# EasyEDA Pro project 智能水杯垫.epro, schematic Schematic1
Create Date: 2024-09-26; Page Name: P1; Project Name: 智能水杯垫; Schematic Name: Schematic1; Update Date: 2024-10-15; Company: 嘉立创EDA; Page Size: A4; Version: V1.0
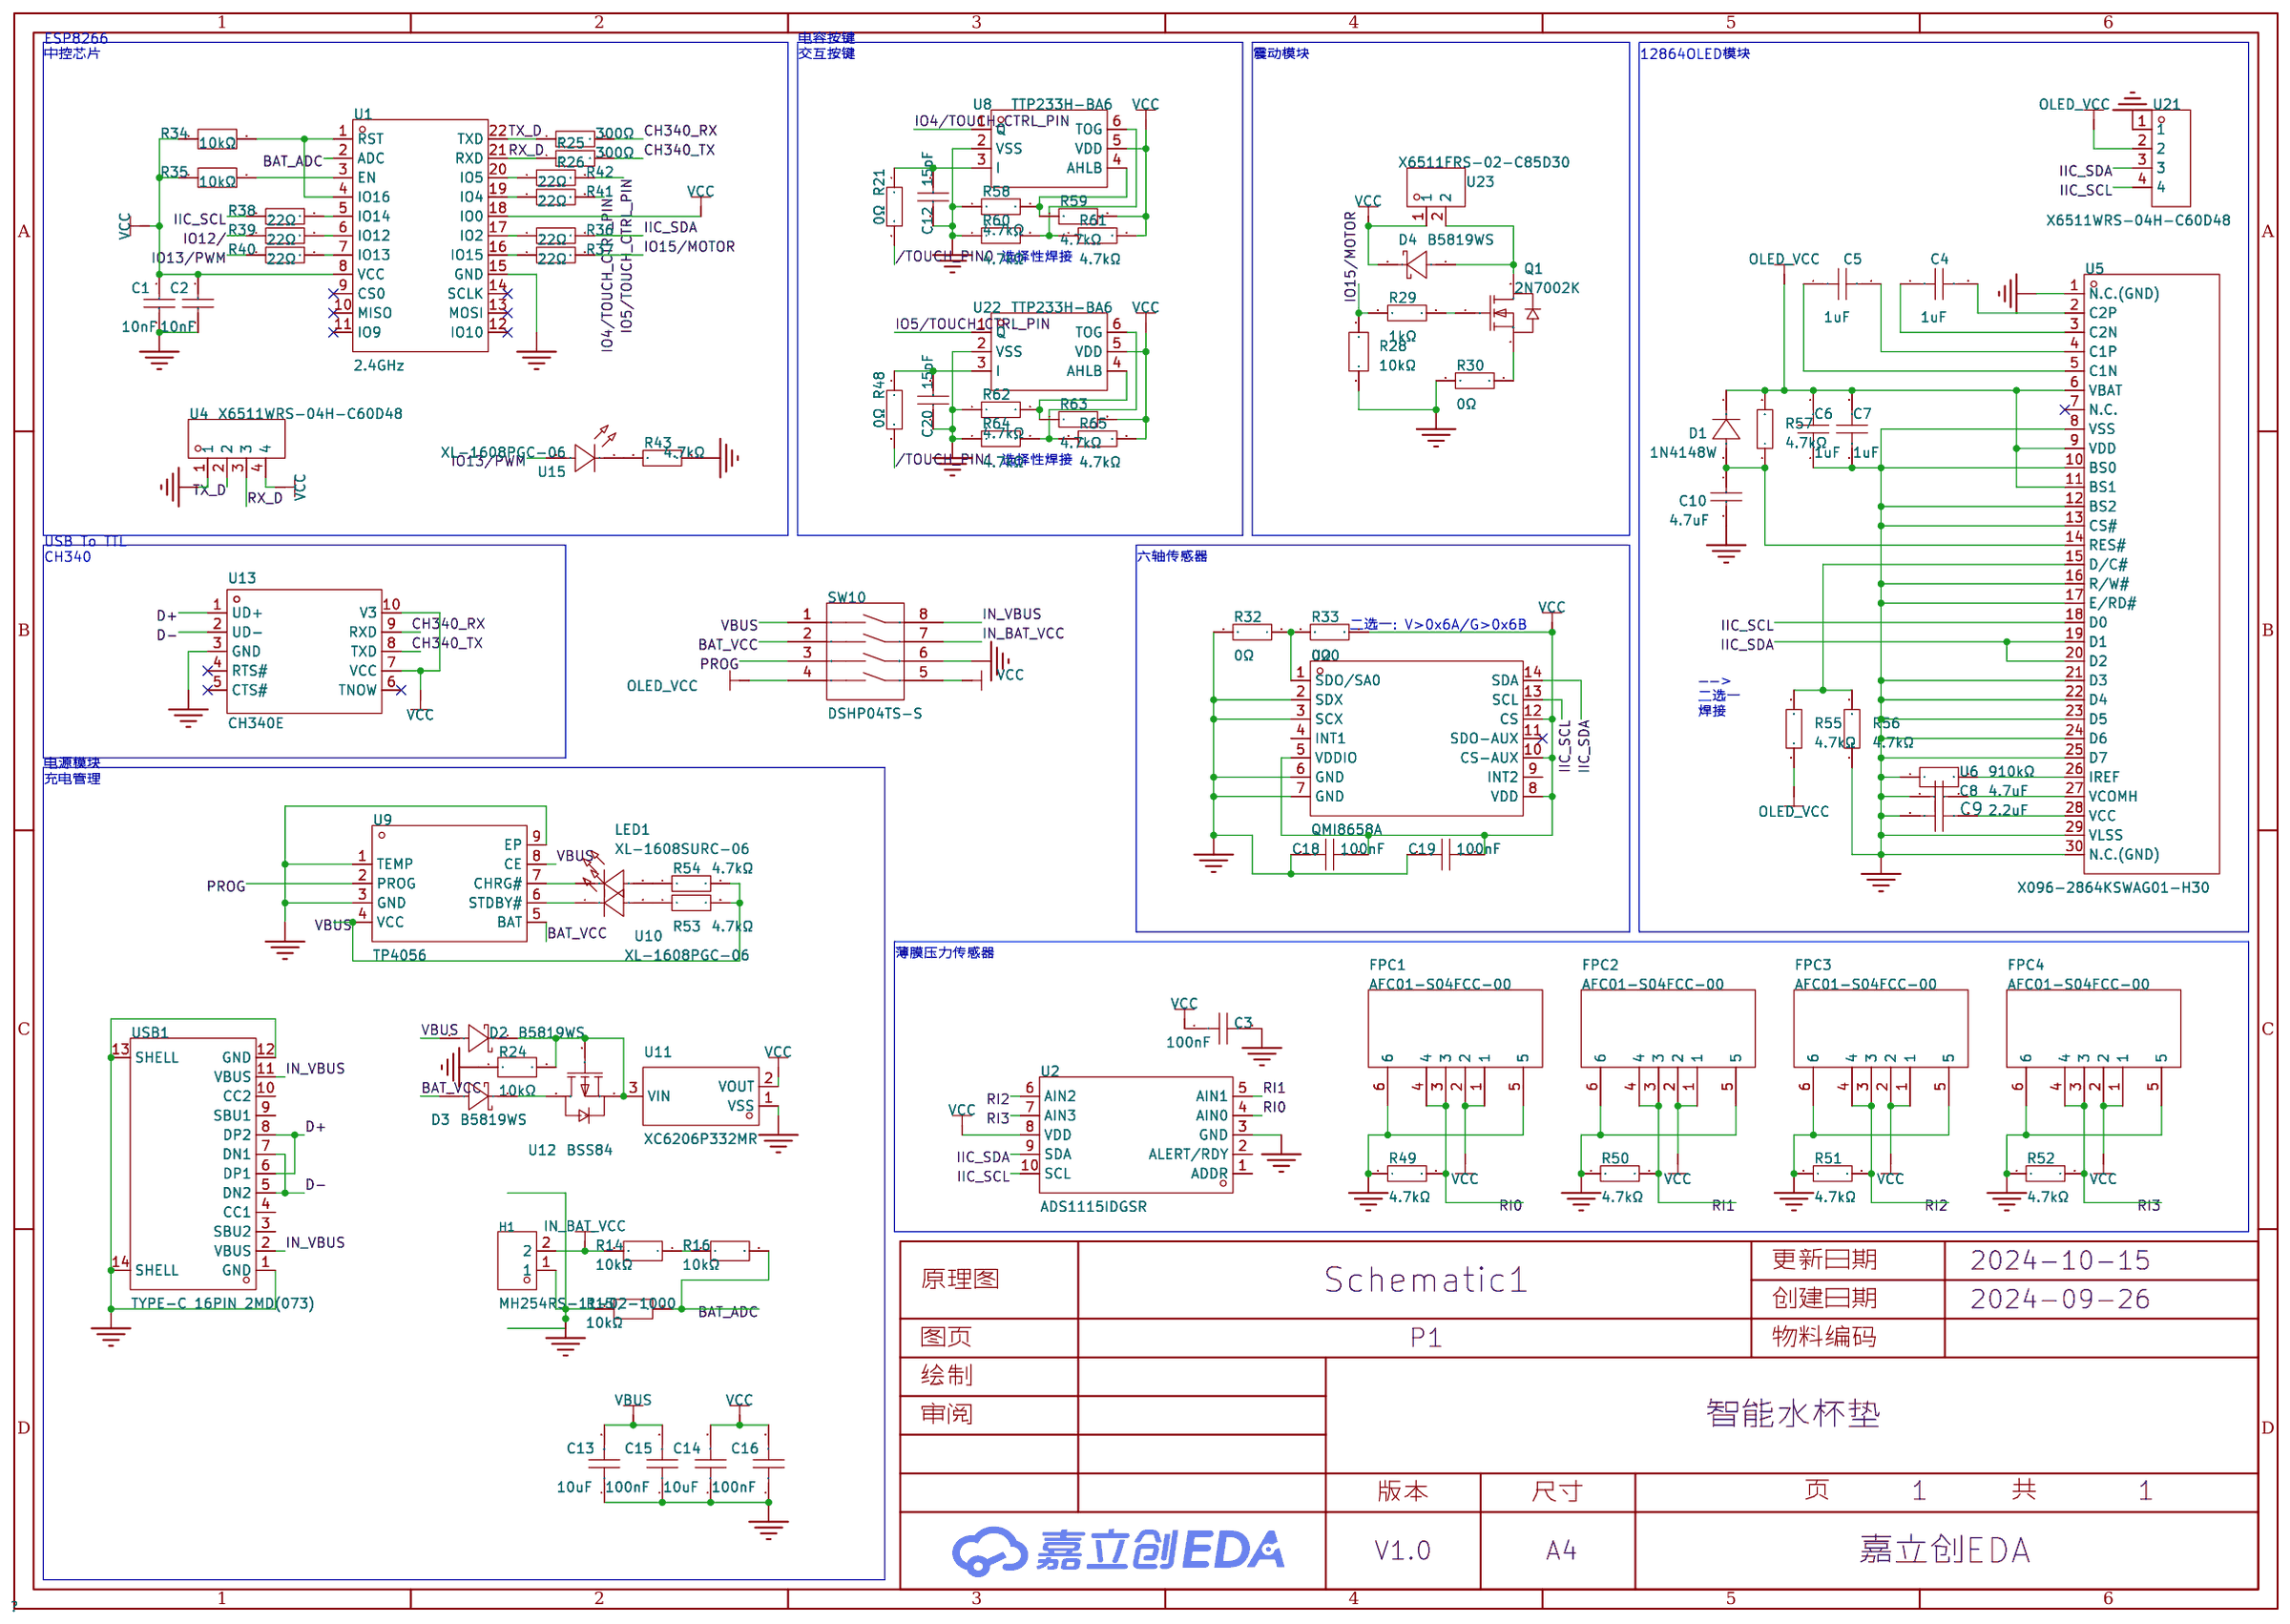
[diagram p0: schematic sheet]

## Parts
C1  10nF  [C0603]
C2  10nF  [C0603]
C3  100nF  [C0603]
C4  1uF  [C0603]
C5  1uF  [C0603]
C6  1uF  [C0603]
C7  1uF  [C0603]
C8  4.7uF  [C0603]
C9  2.2uF  [C0603]
C10  4.7uF  [C0603]
C12  15pF  [C0603]
C13  10uF  [C0603]
C14  10uF  [C0603]
C15  100nF  [C0603]
C16  100nF  [C0603]
C18  100nF  [C0603]
C19  100nF  [C0603]
C20  15pF  [C0603]
D1  1N4148W  [SOD-123_L2.8-W1.8-LS3.7-RD-1]
D2  B5819WS  [SOD-323_L1.7-W1.3-LS2.5-FD]
D3  B5819WS  [SOD-323_L1.7-W1.3-LS2.5-FD]
D4  B5819WS  [SOD-323_L1.7-W1.3-LS2.5-FD]
FPC1  AFC01-S04FCC-00  [FFC-SMD_4P-P0.50_AFC01-S04FCC-00]
FPC2  AFC01-S04FCC-00  [FFC-SMD_4P-P0.50_AFC01-S04FCC-00]
FPC3  AFC01-S04FCC-00  [FFC-SMD_4P-P0.50_AFC01-S04FCC-00]
FPC4  AFC01-S04FCC-00  [FFC-SMD_4P-P0.50_AFC01-S04FCC-00]
H1  MH254RS-11-02-1000  [CONN-SMD_MH254RS-11-02-1000]
LED1  XL-1608SURC-06  [LED0603-RD_RED]
Q1  2N7002K  [SOT-23-3_L2.9-W1.3-P1.90-LS2.4-BR]
R14  10kΩ  [R0603]
R15  10kΩ  [R0603]
R16  10kΩ  [R0603]
R21  0Ω  [R0603]
R24  10kΩ  [R0603]
R25  300Ω  [R0603]
R26  300Ω  [R0603]
R28  10kΩ  [R0603]
R29  1kΩ  [R0603]
R30  0Ω  [R0603]
R32  0Ω  [R0603]
R33  0Ω  [R0603]
R34  10kΩ  [R0603]
R35  10kΩ  [R0603]
R36  22Ω  [R0603]
R37  22Ω  [R0603]
R38  22Ω  [R0603]
R39  22Ω  [R0603]
R40  22Ω  [R0603]
R41  22Ω  [R0603]
R42  22Ω  [R0603]
R43  4.7kΩ  [R0603]
R48  0Ω  [R0603]
R49  4.7kΩ  [R0603]
R50  4.7kΩ  [R0603]
R51  4.7kΩ  [R0603]
R52  4.7kΩ  [R0603]
R53  4.7kΩ  [R0603]
R54  4.7kΩ  [R0603]
R55  4.7kΩ  [R0603]
R56  4.7kΩ  [R0603]
R57  4.7kΩ  [R0603]
R58  4.7kΩ  [R0603]
R59  4.7kΩ  [R0603]
R60  4.7kΩ  [R0603]
R61  4.7kΩ  [R0603]
R62  4.7kΩ  [R0603]
R63  4.7kΩ  [R0603]
R64  4.7kΩ  [R0603]
R65  4.7kΩ  [R0603]
SW10  DSHP04TS-S  [SW-SMD_8P-L6.7-W5.4-P1.27-LS8.5]
U1  2.4GHz  [wifim-smd_esp-f]
U2  ADS1115IDGSR  [MSOP-10_L3.0-W3.0-P0.50-LS5.0-BL]
U4  X6511WRS-04H-C60D48  [HDR-SMD_4P-P2.54-H-M-W13.3-N]
U5  X096-2864KSWAG01-H30  [LCD-SMD_X096-2864KSWAG01-H30]
U6  910kΩ  [R0603]
U8  TTP233H-BA6  [SOT-23-6_L2.9-W1.7-P0.95-LS2.8-BL]
U9  TP4056  [ESOP-8_L4.9-W3.9-P1.27-LS6.0-BL-EP]
U10  XL-1608PGC-06  [LED0603-RD_GREEN]
U11  XC6206P332MR  [SOT-23-3_L3.0-W1.7-P0.95-LS2.9-BR]
U12  BSS84  [SOT-23-3_L2.9-W1.3-P1.90-LS2.4-BR-1]
U13  CH340E  [MSOP-10_L3.0-W3.0-P0.50-LS5.0-BL]
U15  XL-1608PGC-06  [LED0603-RD_GREEN]
U20  QMI8658A  [LGA-14_L3.0-W2.5-P0.50-TL]
U21  X6511WRS-04H-C60D48  [HDR-SMD_4P-P2.54-H-M-W13.3-N]
U22  TTP233H-BA6  [SOT-23-6_L2.9-W1.7-P0.95-LS2.8-BL]
U23  X6511FRS-02-C85D30  [HDR-SMD_2P-P2.54-H-F-L11.5]
USB1  TYPE-C 16PIN 2MD(073)  [USB-C-SMD_TYPE-C-6PIN-2MD-073]

## Library data of the parts
C1 C2 = CC0603KRX7R9BB103: 容值:10nF;精度:±10%;额定电压:50V;材质(温度系数):X7R;; LCSC Part Name: 10nF ±10% 50V; Supplier Part: C100042; Manufacturer: YAGEO(国巨); Supplier Footprint: 0603; JLCPCB Part Class: 扩展库; Datasheet: https://atta.szlcsc.com/upload/public/pdf/source/20181008/C309510_22F155564471FAF6A489F7D68F34234E.pdf; Supplier: LCSC; Tolerance: ±10%; Voltage Rated: 50V; Temperature Coefficient: X7R
C3 C15 C16 C18 C19 = CGA0603X7R104K500JT: 容值:100nF;精度:±10%;额定电压:50V;材质(温度系数):X7R;; LCSC Part Name: 100nF ±10% 50V; Supplier Part: C6119867; Manufacturer: HRE(芯声); Supplier Footprint: 0603; JLCPCB Part Class: 扩展库; Supplier: LCSC; Tolerance: ±10%; Voltage Rated: 50V; Temperature Coefficient: X7R
C4-C7 = CL10A105KB8NNNC: 容值:1uF;精度:±10%;额定电压:50V;材质(温度系数):X5R;; LCSC Part Name: 1uF ±10% 50V; Supplier Part: C15849; Manufacturer: SAMSUNG(三星); Supplier Footprint: 0603; JLCPCB Part Class: 基础库; Datasheet: https://atta.szlcsc.com/upload/public/pdf/source/20160218/1457707763339.pdf; Supplier: LCSC; Tolerance: ±10%; Voltage Rated: 50V; Temperature Coefficient: X5R
C8 C10 = CL10A475KP8NNNC: 容值:4.7uF;精度:±10%;额定电压:10V;材质(温度系数):X5R;; LCSC Part Name: 4.7uF ±10% 10V; Supplier Part: C1705; Manufacturer: SAMSUNG(三星); Supplier Footprint: 0603; JLCPCB Part Class: 扩展库; Datasheet: https://atta.szlcsc.com/upload/public/pdf/source/20160218/1457707763339.pdf; Supplier: LCSC; Tolerance: ±10%; Voltage Rated: 10V; Temperature Coefficient: X5R
C9 = CL10A225KB8NNNC: 容值:2.2uF;精度:±10%;额定电压:50V;材质(温度系数):X5R;; LCSC Part Name: 2.2uF ±10% 50V; Supplier Part: C913904; Manufacturer: SAMSUNG(三星); Supplier Footprint: 0603; JLCPCB Part Class: 扩展库; Datasheet: https://atta.szlcsc.com/upload/public/pdf/source/20160218/1457707763339.pdf; Supplier: LCSC; Tolerance: ±10%; Voltage Rated: 50V; Temperature Coefficient: X5R
C12 C20 = CC0603JRNPO9BN150: 容值:15pF;精度:±5%;额定电压:50V;材质(温度系数):NP0;; LCSC Part Name: 15pF ±5% 50V; Supplier Part: C107037; Manufacturer: YAGEO(国巨); Supplier Footprint: 0603; JLCPCB Part Class: 扩展库; Datasheet: https://atta.szlcsc.com/upload/public/pdf/source/20170914/C128857_1505359892143968080.pdf; Supplier: LCSC; Tolerance: ±5%; Voltage Rated: 50V; Temperature Coefficient: NP0
C13 C14 = CL10A106MA8NRNC: 容值:10uF;精度:±20%;额定电压:25V;材质(温度系数):X5R;; LCSC Part Name: 10uF ±20% 25V; Supplier Part: C96446; Manufacturer: SAMSUNG(三星); Supplier Footprint: 0603; JLCPCB Part Class: 基础库; Datasheet: https://atta.szlcsc.com/upload/public/pdf/source/20160218/1457707763339.pdf; Supplier: LCSC; Tolerance: ±20%; Voltage Rated: 25V; Temperature Coefficient: X5R
D1 = 1N4148W_C917030: 二极管配置:独立式;正向压降(Vf):1.25V@150mA;直流反向耐压(Vr):100V;整流电流:300mA;反向恢复时间(trr):8ns;; LCSC Part Name: 电压:100V 电流:300mA; Supplier Part: C917030; Manufacturer: JSMSEMI(杰盛微); Supplier Footprint: SOD-123; JLCPCB Part Class: 扩展库; Datasheet: https://atta.szlcsc.com/upload/public/pdf/source/20230807/C928F35F082AC22834996B2570733516.pdf; Supplier: LCSC; Diode Configuration: 独立式; Forward Voltage (Vf@If): 1.25V@150mA; Reverse Voltage (Vr): 100V; Rectified Current: 300mA; Reverse Leakage Current: 1uA@75V; Reverse Recovery Time (trr): 8ns; Operating Temperature: -55℃~+150℃@(Tj)
D2-D4 = B5819WS_C7420331: 二极管配置:独立式;正向压降(Vf):600mV@1.0A;直流反向耐压(Vr):40V;平均整流电流(Io):1A;; LCSC Part Name: 电压:40V 电流:1A; Supplier Part: C7420331; Manufacturer: 宏迦橙; Supplier Footprint: SOD-323; JLCPCB Part Class: 扩展库; Datasheet: https://atta.szlcsc.com/upload/public/pdf/source/20230828/03CA0F4F90DAE368A7153B7B5E4D0651.pdf; Supplier: LCSC; Diode Configuration: 独立式; Forward Voltage (Vf@If): 600mV@1.0A; Reverse Voltage (Vr): 40V; Average Rectified Current (Io): 1A; Reverse Leakage Current (Ir): 1mA@40V; Peak forward surge current: 10A
FPC1-FPC4 = AFC01-S04FCC-00: 锁定特性:翻盖式;触点类型:下接;触点数量:4P;间距:0.5mm;安装类型:卧贴;; LCSC Part Name: 间距:0.5mm P数:4P 翻盖式 下接; Supplier Part: C262260; Manufacturer: JS(钜硕电子); Supplier Footprint: SMD,P=0.5mm,卧贴; JLCPCB Part Class: 扩展库; Datasheet: https://atta.szlcsc.com/upload/public/pdf/source/20190816/C413942_2A72D1AC756EAE17EEDF756A339D4500.pdf; Supplier: LCSC; Locking Feature: 翻盖式; Contact Type: 下接; Number of Contacts: 4P; Pitch: 0.5mm; Mounting Type: 卧贴; FFC, FCB Thickness: 0.3mm; Height Above Board: 2mm
H1 = MH254RS-11-02-1000: 插针结构:1x2P;间距:2.54mm;行距:-;圆针/方针:圆针;安装类型:卧贴;排数:单排;总PIN位数:2P;额定电流:3A;额定电压:-;配合针长度:3.5mm;塑高:3mm;端接针长度:-;触头材质:-;工作温度范围:-40℃~+105℃;颜色:黑色;; LCSC Part Name: 间距:2.54mm 1x2P 卧贴 圆针; Supplier Part: C668122; Manufacturer: XFCN(兴飞); Supplier Footprint: SMD,P=2.54mm,卧贴; JLCPCB Part Class: 扩展库; Datasheet: https://atta.szlcsc.com/upload/public/pdf/source/20200618/C668122_1D27873015DA402FDED001B2AD26FB3F.pdf; Supplier: LCSC; Pin Structure: 1x2P; Pitch: 2.54mm; Circluar Pins/Square Pins: 圆针; Mounting Type: 卧贴; Number of Rows: 单排; Number of Pins: 2P; Current Rating (Max): 3A; Length of Mating Pin: 3.5mm; Insulation Height: 3mm; Operating Temperature Range: -40℃~+105℃; Color: 黑色
LED1 = XL-1608SURC-06: 发光颜色:红色;功率:55mW;正向电流:25mA;主波长:617nm~621nm;透镜颜色:无色透明透镜;色温:-;发光角度:120°;载带方式:正贴;工作温度:-30℃~+85℃;; Supplier Part: C965799; Manufacturer: XINGLIGHT(成兴光); Supplier Footprint: 0603; JLCPCB Part Class: 扩展库; Datasheet: https://atta.szlcsc.com/upload/public/pdf/source/20221102/D860AFDD1CDB02C5A8064103A32707E2.pdf; Supplier: LCSC; Emitted Color: 红色; Power Dissipation: 55mW; Forward Current: 25mA; Dominant Wavelength: 617nm~621nm; Peak Wavelength: 623nm; Lens Color: 无色透明透镜; Viewing Angle: 120°; Mounting Sytle: 正贴; Operating Temperature: -30℃~+85℃
Q1 = 2N7002K_C414015: 类型:1个N沟道;漏源电压(Vdss):60V;连续漏极电流(Id):300mA;功率(Pd):300mW;导通电阻(RDS(on)@Vgs,Id):1.9Ω@10V,300mA;阈值电压(Vgs(th)@Id):1.5V@250uA;; LCSC Part Name: 1个N沟道 耐压:60V 电流:300mA; Supplier Part: C414015; Manufacturer: MDD(辰达半导体); Supplier Footprint: SOT-23; JLCPCB Part Class: 扩展库; Datasheet: https://atta.szlcsc.com/upload/public/pdf/source/20240726/5946106B7C0E9CB850E5C6D2D8EA051B.pdf; Supplier: LCSC; Type: 1个N沟道; Drain Source Voltage (Vdss): 60V; Continuous Drain Current (Id): 300mA; Power Dissipation (Pd): 300mW; Drain Source On Resistance (RDS(on)@Vgs,Id): 1.9Ω@10V,300mA; Gate Threshold Voltage (Vgs(th)@Id): 1.5V@250uA; Total Gate Charge (Qg@Vgs): 1.22nC@10V; Input Capacitance (Ciss@Vds): 21pF@30V; Reverse Transfer Capacitance (Crss@Vds): 4pF@30V
R14-R16 R24 R28 R34 R35 = FRC0603J103TS: 电阻类型:厚膜电阻;阻值:10kΩ;精度:±5%;功率:100mW;最大工作电压:75V;温度系数:±100ppm/℃;; LCSC Part Name: 10kΩ ±5% 100mW 厚膜电阻; Supplier Part: C2930027; Manufacturer: FOJAN(富捷); Supplier Footprint: 0603; JLCPCB Part Class: 扩展库; Datasheet: https://atta.szlcsc.com/upload/public/pdf/source/20211221/925EC7D7225764EE0046F22065062C87.pdf; Supplier: LCSC; Type: 厚膜电阻; Tolerance: ±5%; Power(Watts): 100mW; Overload Voltage (Max): 75V; Temperature Coefficient: ±100ppm/℃; Operating Temperature Range: -55℃~+155℃
R21 R30 R32 R33 R48 = 0603WAF0000T5E: 电阻类型:厚膜电阻;阻值:0Ω;精度:±1%;功率:100mW;最大工作电压:75V;; LCSC Part Name: 0Ω ±1% 100mW 厚膜电阻; Supplier Part: C21189; Manufacturer: UNI-ROYAL(厚声); Supplier Footprint: 0603; JLCPCB Part Class: 基础库; Datasheet: https://atta.szlcsc.com/upload/public/pdf/source/20200306/C422600_1E6D84923E4A46A82E41ADD87F860B5C.pdf; Supplier: LCSC; Type: 厚膜电阻; Tolerance: ±1%; Power(Watts): 100mW; Overload Voltage (Max): 75V; Operating Temperature Range: -55℃~+155℃
R25 R26 = 0603WAF3000T5E: 电阻类型:厚膜电阻;阻值:300Ω;精度:±1%;功率:100mW;最大工作电压:75V;温度系数:±100ppm/℃;; LCSC Part Name: 300Ω ±1% 100mW 厚膜电阻; Supplier Part: C23025; Manufacturer: UNI-ROYAL(厚声); Supplier Footprint: 0603; JLCPCB Part Class: 基础库; Datasheet: https://atta.szlcsc.com/upload/public/pdf/source/20200306/C422600_1E6D84923E4A46A82E41ADD87F860B5C.pdf; Supplier: LCSC; Type: 厚膜电阻; Tolerance: ±1%; Power(Watts): 100mW; Overload Voltage (Max): 75V; Temperature Coefficient: ±100ppm/℃; Operating Temperature Range: -55℃~+155℃
R29 = 0603WAF1001T5E: 电阻类型:厚膜电阻;阻值:1kΩ;精度:±1%;功率:100mW;最大工作电压:75V;温度系数:±100ppm/℃;; LCSC Part Name: 1kΩ ±1% 100mW 厚膜电阻; Supplier Part: C21190; Manufacturer: UNI-ROYAL(厚声); Supplier Footprint: 0603; JLCPCB Part Class: 基础库; Datasheet: https://atta.szlcsc.com/upload/public/pdf/source/20200306/C422600_1E6D84923E4A46A82E41ADD87F860B5C.pdf; Supplier: LCSC; Type: 厚膜电阻; Tolerance: ±1%; Power(Watts): 100mW; Overload Voltage (Max): 75V; Temperature Coefficient: ±100ppm/℃; Operating Temperature Range: -55℃~+155℃
R36-R42 = 0603WAF220JT5E: 电阻类型:厚膜电阻;阻值:22Ω;精度:±1%;功率:100mW;最大工作电压:75V;温度系数:±100ppm/℃;; LCSC Part Name: 22Ω ±1% 100mW 厚膜电阻; Supplier Part: C23345; Manufacturer: UNI-ROYAL(厚声); Supplier Footprint: 0603; JLCPCB Part Class: 基础库; Datasheet: https://atta.szlcsc.com/upload/public/pdf/source/20200306/C422600_1E6D84923E4A46A82E41ADD87F860B5C.pdf; Supplier: LCSC; Type: 厚膜电阻; Tolerance: ±1%; Power(Watts): 100mW; Overload Voltage (Max): 75V; Temperature Coefficient: ±100ppm/℃; Operating Temperature Range: -55℃~+155℃
R43 R49-R65 = RC0603FR-074K7L: 电阻类型:厚膜电阻;阻值:4.7kΩ;精度:±1%;功率:100mW;最大工作电压:75V;温度系数:±100ppm/℃;; LCSC Part Name: 厚膜电阻 4.7kΩ ±1% 100mW; Supplier Part: C99782; Manufacturer: YAGEO(国巨); Supplier Footprint: 0603; JLCPCB Part Class: 扩展库; Datasheet: https://atta.szlcsc.com/upload/public/pdf/source/20180224/C181757_15194369480721363983.pdf; Supplier: LCSC; Type: 厚膜电阻; Tolerance: ±1%; Power(Watts): 100mW; Overload Voltage (Max): 75V; Temperature Coefficient: ±100ppm/℃; Operating Temperature Range: -55℃~+155℃
SW10 = DSHP04TS-S: 类型:平拨,凹槽式;电路结构:单刀单掷;开关位数:4位;额定电流:25mA;额定电压:24V;使用寿命:3千次;颜色:黑色;; LCSC Part Name: 间距1.27mm 平拨,凹槽式 4位拨码开关; Supplier Part: C319050; Manufacturer: XKB Connectivity(中国星坤); Supplier Footprint: SMD-8P,5.4x6.7mm; JLCPCB Part Class: 扩展库; Datasheet: https://atta.szlcsc.com/upload/public/pdf/source/20211009/11BE85C99D2C85B0991AF4F9D6EB8BDE.pdf; Supplier: LCSC; Type: 平拨,凹槽式; Circuit: 单刀单掷; Number of Positions: 4位; Pin Style: 鸥翼型; Lead Pitch: 1.27mm; Current Rating: 25mA; Voltage Rating: 24V; Operating Temperature: -20℃~+70℃; Operating Life: 3千次; Color: 黑色
U1 = ESP-F: 频率:2.4GHz;天线形式:PCB;发射功率:15dBm;接收灵敏度:-96dBm;; LCSC Part Name: ESP8266 WiFi模组,32Mbit Flash,PCB天线; Supplier Part: C19949062; Manufacturer: DOIT(四博智联); Supplier Footprint: SMD,24x16mm; JLCPCB Part Class: 扩展库; Datasheet: https://atta.szlcsc.com/upload/public/pdf/source/20240112/05F6F2C86FDD1F6947C644A916589E92.pdf; Supplier: LCSC; Wireless Standard: WIFI4; Support Interface: IO；UART; Antenna Type: PCB; Output Power: 15dBm; Operating Voltage: 3.3V; Receive  Current: 55mA; Send  Current: 375mA; Sensitivity: -96dBm; Operating Temperature: -40℃~+85℃
U2 = ADS1115IDGSR: 接口:I2C;电源电压:2V~5.5V;采样率:860Hz;分辨率:16位;; LCSC Part Name: 具有内部基准、振荡器和可编程比较器且兼容 I2C 的ADS111x、超小型、低功耗 860SPS、16位ADC; Supplier Part: C37593; Manufacturer: TI(德州仪器); Supplier Footprint: VSSOP-10; JLCPCB Part Class: 扩展库; Datasheet: https://www.ti.com/cn/lit/gpn/ads1115; Supplier: LCSC; Interface: I2C; differential input: 是; number of channels: 2; Supply Voltage: 2V~5.5V; sampling frequency: 860Hz; resolution: 16位; Operating Temperature: -40℃~+125℃
U4 U21 = X6511WRS-04H-C60D48: 插针结构:1x4P;间距:2.54mm;行距:2.54mm;圆针/方针:方针;安装类型:-;排数:单排;总PIN位数:4P;额定电流:3A;额定电压:250V;配合针长度:-;塑高:2.5mm;端接针长度:-;触头材质:黄铜;触头镀层:金;工作温度范围:-40℃~+105℃;焊接温度(最大值):260℃;颜色:黑色;; LCSC Part Name: 1x4P 间距:2.54mm 方针; Supplier Part: C5242197; Manufacturer: XKB Connection(中国星坤); Supplier Footprint: SMD,P=2.54mm; JLCPCB Part Class: 扩展库; Datasheet: https://atta.szlcsc.com/upload/public/pdf/source/20221103/EADF72CF36CD96D511D8188ACEE72315.pdf; Supplier: LCSC; Pin Structure: 1x4P; Pitch: 2.54mm; Row Spacing: 2.54mm; Circluar Pins/Square Pins: 方针; Number of Rows: 单排; Number of Pins: 4P; Current Rating (Max): 3A; Voltage Rating (Max): 250V; Insulation Height: 2.5mm; Contact Material: 黄铜; Contact Plating: 金; Operating Temperature Range: -40℃~+105℃; Soldering Temperature(Max): 260℃; Color: 黑色
U5 = X096-2864KSWAG01-H30: 主控芯片:SSD1315;尺寸(inch):0.96;像素分辨率:128x64;; LCSC Part Name: 0.96寸 白光 128x64像素分辨率 30PIN; Supplier Part: C5123563; Manufacturer: Newvision(新智景); JLCPCB Part Class: 扩展库; Datasheet: https://atta.szlcsc.com/upload/public/pdf/source/20220805/0CBF3995E81D02B55D6A971F6BD83BE7.pdf; Supplier: LCSC; Main Control Chip: SSD1315; Size: 0.96; Pixel Resolution: 128x64
U6 = FRC0603F9103TS: 电阻类型:厚膜电阻;阻值:910kΩ;精度:±1%;功率:100mW;最大工作电压:75V;温度系数:±100ppm/℃;; LCSC Part Name: 910kΩ ±1% 100mW 厚膜电阻; Supplier Part: C2907075; Manufacturer: FOJAN(富捷); Supplier Footprint: 0603; JLCPCB Part Class: 扩展库; Datasheet: https://atta.szlcsc.com/upload/public/pdf/source/20211221/925EC7D7225764EE0046F22065062C87.pdf; Supplier: LCSC; Type: 厚膜电阻; Tolerance: ±1%; Power(Watts): 100mW; Overload Voltage (Max): 75V; Temperature Coefficient: ±100ppm/℃; Operating Temperature Range: -55℃~+155℃
U8 U22 = TTP233H-BA6: Supplier Part: C2890349; Manufacturer: TONTEK(通泰); Supplier Footprint: SOT-23-6L; JLCPCB Part Class: 扩展库; Datasheet: https://atta.szlcsc.com/upload/public/pdf/source/20210906/B48FDD4D347312208019B4D153A9DAB9.pdf; Supplier: LCSC
U9 = TP4056_C725790: Supplier Part: C725790; Manufacturer: UMW(友台半导体); Supplier Footprint: ESOP-8; JLCPCB Part Class: 扩展库; Datasheet: https://atta.szlcsc.com/upload/public/pdf/source/20231109/CF74897CE79A500F7FE27A45ADCCC631.pdf; Supplier: LCSC
U10 U15 = XL-1608PGC-06: 灯头类型:-;发光颜色:翠绿色;正向电压(VF):2.6V~3V;功率:75mW;正向电流:5mA;主波长:505nm~540nm;二极管配置:-;透镜颜色:绿色透镜;色温:-;发光强度:299mcd;发光角度:130°;载带方式:正贴;工作温度:-;; Supplier Part: C7371905; Manufacturer: XINGLIGHT(成兴光); Supplier Footprint: 0603; JLCPCB Part Class: 扩展库; Datasheet: https://atta.szlcsc.com/upload/public/pdf/source/20240218/2F8A7AF596DEEB38157DAB7856E382C0.pdf; Supplier: LCSC; Emitted Color: 翠绿色; Forward Voltage (VF): 2.6V~3V; Power Dissipation: 75mW; Forward Current: 5mA; Dominant Wavelength: 505nm~540nm; Peak Wavelength: 530nm; Lens Color: 绿色透镜; Luminous Intensity: 299mcd; Viewing Angle: 130°; Mounting Sytle: 正贴
U11 = XC6206P332MR_C347376: 输出类型:固定;最大输入电压:8V;输出电压:3.3V;最大输出电流:250mA;电源纹波抑制比(PSRR):40dB@(1kHz);输出极性:正极;; LCSC Part Name: 输入8V 输出3.3V 250mA; Supplier Part: C347376; Manufacturer: UMW(友台半导体); Supplier Footprint: SOT-23; JLCPCB Part Class: 扩展库; Datasheet: https://atta.szlcsc.com/upload/public/pdf/source/20231109/6B10DA60E52FC900BF97E3EFEB5D6341.pdf; Supplier: LCSC; Output Type: 固定; Maximum Input Voltage: 8V; Output Voltage: 3.3V; MAX Output Current: 250mA; Power Supply Rejection Ratio (PSRR): 40dB@(1kHz); Dropout Voltage: 240mV@(50mA); Operating Temperature: -25℃~+80℃; Output Polarity: 正极; Number of Outputs: 1
U12 = BSS84_C7420340: 类型:1个P沟道;漏源电压(Vdss):60V;连续漏极电流(Id):170mA;功率(Pd):225mW;导通电阻(RDS(on)@Vgs,Id):8Ω@10V,0.17A;阈值电压(Vgs(th)@Id):2V@250uA;; LCSC Part Name: 1个P沟道 耐压:60V 电流:170mA; Supplier Part: C7420340; Manufacturer: 宏迦橙; Supplier Footprint: SOT-23; JLCPCB Part Class: 扩展库; Datasheet: https://atta.szlcsc.com/upload/public/pdf/source/20230630/CFCF3EFF80655E4500DCC7BD4B2736C9.pdf; Supplier: LCSC; Type: 1个P沟道; Drain Source Voltage (Vdss): 60V; Continuous Drain Current (Id): 170mA; Power Dissipation (Pd): 225mW; Drain Source On Resistance (RDS(on)@Vgs,Id): 8Ω@10V,0.17A; Gate Threshold Voltage (Vgs(th)@Id): 2V@250uA; Total Gate Charge (Qg@Vgs): 1.77nC@10V; Input Capacitance (Ciss@Vds): 43pF@30V; Reverse Transfer Capacitance (Crss@Vds): 2.8pF@30V; Operating Temperature: -55℃~+150℃
U13 = CH340E: 应用功能:收发器;接口协议:USB 2.0;数据速率:2Mbps;; LCSC Part Name: USB转串口芯片 CH340; Supplier Part: C99652; Manufacturer: WCH(南京沁恒); Supplier Footprint: MSOP-10; JLCPCB Part Class: 扩展库; Datasheet: https://atta.szlcsc.com/upload/public/pdf/source/20230530/6E401E9554E9F5311886CC8B3F89B62E.pdf; Supplier: LCSC; Applications Function: 收发器; Protocol: USB 2.0; Supply Voltage: 3.3V；5V; Data Rate: 2Mbps
U20 = QMI8658A_C3021082: LCSC Part Name: 六轴陀螺仪; Supplier Part: C3021082; Manufacturer: QST(上海矽睿); Supplier Footprint: LGA-14; JLCPCB Part Class: 扩展库; Datasheet: https://atta.szlcsc.com/upload/public/pdf/source/20230804/748E61E1BAEF8C31413DC641004C80DF.pdf; Supplier: LCSC
U23 = X6511FRS-02-C85D30: 插孔结构:1x2P;间距:2.54mm;安装类型:卧贴;排数:单排;总孔位数:2P;塑高:8.5mm;; LCSC Part Name: 间距:2.54mm 1x2P 卧贴; Supplier Part: C5142235; Manufacturer: XKB Connectivity(中国星坤); Supplier Footprint: SMD,P=2.54mm,卧贴; JLCPCB Part Class: 扩展库; Datasheet: https://atta.szlcsc.com/upload/public/pdf/source/20220822/AB9A82E80C220285963E5EFA3BFD32FF.pdf; Supplier: LCSC; Holes Structure: 1x2P; Pitch: 2.54mm; Mounting Type: 卧贴; Number of Rows: 单排; Number of Holes: 2P; Insulation Height: 8.5mm
USB1 = TYPE-C 16PIN 2MD(073): 连接器类型:Type-C;标准:USB 3.1;公母:母;安装方式:卧贴;触点数量:16P;端口数量:1;额定电流 - 电源:5A;工作温度范围:-25℃~+85℃;; LCSC Part Name: Type-C 母 卧贴; Supplier Part: C2765186; Manufacturer: SHOU HAN(首韩); Supplier Footprint: SMD; JLCPCB Part Class: 扩展库; Datasheet: https://atta.szlcsc.com/upload/public/pdf/source/20211123/39B17C16241EAC15C5E277BDA434118E.pdf; Supplier: LCSC; Connector Type: Type-C; Standard: USB 3.1; Gender: 母; Mounting Style: 卧贴; Number of Contacts: 16P; Number of Ports: 1; Current Rating - Power (Max): 5A; Operating Temperature Range: -25℃~+85℃; Rated Voltage (Max): 5V; Connect-Disconnect Life: 5千次; Core Colour: 黑色

## Nets
GND: C1.1 C2.1 C3.2 C6.1 C7.1 C8.1 C9.1 C10.2 C12.1 C13.1 C14.1 C15.1 C16.1 C18.2 C19.2 C20.1 FPC1.5 FPC1.6 FPC2.5 FPC2.6 FPC3.5 FPC3.6 FPC4.5 FPC4.6 H1.1 R15.1 R24.1 R28.1 R30.2 R32.2 R43.2 R49.1 R50.1 R51.1 R52.1 R56.1 R58.1 R60.1 R62.1 R64.1 SW10.6 U1.15(GND) U2.3(GND) U4.1 U5.1(N.C.(GND)) U5.8(VSS) U5.10(BS0) U5.12(BS2) U5.13(CS#) U5.16(R/W#) U5.17(E/RD#) U5.21(D3) U5.22(D4) U5.23(D5) U5.24(D6) U5.25(D7) U5.29(VLSS) U5.30(N.C.(GND)) U6.1 U8.2(VSS) U9.1(TEMP) U9.3(GND) U9.9(EP) U11.1(VSS) U13.3(GND) U20.2(SDX) U20.3(SCX) U20.6(GND) U20.7(GND) U21.1 U22.2(VSS) USB1.1(GND) USB1.12(GND) USB1.13(SHELL) USB1.14(SHELL)
VBUS: C13.2 C15.2 D2.1(A) R53.2 R54.2 SW10.1 U9.4(VCC) U9.8(CE)
VCC: C1.2 C2.2 C3.1 C14.2 C16.2 C18.1 C19.1 D4.2(K) FPC1.1 FPC1.2 FPC2.1 FPC2.2 FPC3.1 FPC3.2 FPC4.1 FPC4.2 R33.1 R34.1 R35.1 R59.2 R61.2 R63.2 R65.2 SW10.5 U1.8(VCC) U1.18(IO0) U2.8(VDD) U4.4 U8.5(VDD) U11.2(VOUT) U13.7(VCC) U13.10(V3) U20.5(VDDIO) U20.8(VDD) U20.10(CS-AUX) U20.12(CS) U22.5(VDD) U23.1
/TOUCH_PIN0: R21.2
/TOUCH_PIN1: R48.2
BAT_ADC: R15.2 R16.2 U1.2(ADC)
BAT_VCC: D3.1(A) SW10.2 U9.5(BAT)
CH340_RX: R25.2 U13.9(RXD)
CH340_TX: R26.2 U13.8(TXD)
D+: U13.1(UD+) USB1.6(DP1) USB1.8(DP2)
D-: U13.2(UD-) USB1.5(DN2) USB1.7(DN1)
IIC_SCL: R38.1 U2.10(SCL) U5.18(D0) U20.13(SCL) U21.4
IIC_SDA: R36.2 U2.9(SDA) U5.19(D1) U5.20(D2) U20.14(SDA) U21.3
IN_BAT_VCC: H1.2 R14.2 SW10.7
IN_VBUS: SW10.8 USB1.2(VBUS) USB1.11(VBUS)
IO4/TOUCH_CTRL_PIN: R41.2 U8.1(Q)
IO5/TOUCH_CTRL_PIN: R42.2 U22.1(Q)
IO12/: R39.1
IO13/PWM: R40.1 U15.2(A)
IO15/MOTOR: R28.2 R29.2 R37.2
OLED_VCC: C6.2 C7.2 D1.1(C) R55.1 R57.2 SW10.4 U5.6(VBAT) U5.9(VDD) U5.11(BS1) U21.2
PROG: SW10.3 U9.2(PROG)
RI0: FPC1.3 FPC1.4 R49.2 U2.4(AIN0)
RI1: FPC2.3 FPC2.4 R50.2 U2.5(AIN1)
RI2: FPC3.3 FPC3.4 R51.2 U2.6(AIN2)
RI3: FPC4.3 FPC4.4 R52.2 U2.7(AIN3)
RX_D: R26.1 U1.21(RXD) U4.3
TX_D: R25.1 U1.22(TXD) U4.2
$1N6131: C4.2 U5.2(C2P)
$1N6135: C4.1 U5.3(C2N)
$1N6207: C5.2 U5.4(C1P)
$1N6245: C5.1 U5.5(C1N)
$1N6748: U5.26(IREF) U6.2
$1N6861: C8.2 U5.27(VCOMH)
$1N6934: C9.2 U5.28(VCC)
$1N7057: C10.1 D1.2(A) R57.1 U5.14(RES#)
$1N7351: R55.2 R56.2 U5.15(D/C#)
$1N8175: R35.2 U1.3(EN)
$1N8529: R14.1 R16.1
$1N8683: R58.2 R59.1 U8.4(AHLB)
$1N8688: R60.2 R61.1 U8.6(TOG)
$1N8917: C12.2 R21.1 U8.3(I)
$1N11483: LED1.1(K) U9.7(CHRG#)
$1N11695: U9.6(STDBY#) U10.1(K)
$1N15528: D3.2(K) U12.3(D)
$1N15646: D2.2(K) R24.2 U11.3(VIN) U12.1(G) U12.2(S)
$1N16309: R34.2 U1.1(RST) U1.4(IO16)
$1N17027: R43.1 U15.1(K)
$1N17621: Q1.1(G) R29.1
$1N17824: D4.1(A) Q1.3(D) U23.2
$1N17925: Q1.2(S) R30.1
$1N18978: R32.1 R33.2 U20.1(SDO/SA0)
$1N20279: R38.2 U1.5(IO14)
$1N20282: R39.2 U1.6(IO12)
$1N20285: R40.2 U1.7(IO13)
$1N20288: R36.1 U1.17(IO2)
$1N20291: R37.1 U1.16(IO15)
$1N20612: R41.1 U1.19(IO4)
$1N20651: R42.1 U1.20(IO5)
$1N21639: R62.2 R63.1 U22.4(AHLB)
$1N21644: R64.2 R65.1 U22.6(TOG)
$1N21653: C20.2 R48.1 U22.3(I)
$1N22004: LED1.2(A) R54.1
$1N22006: R53.1 U10.2(A)

Not connected (* = marked no-connect by the designer): U1 9(CS0)* 10(MISO)* 11(IO9)* 12(IO10)* 13(MOSI)* 14(SCLK)*; U2 1(ADDR) 2(ALERT/RDY); U5 7(N.C.)*; U13 4(RTS#)* 5(CTS#)* 6(TNOW)*; U20 4(INT1) 9(INT2) 11(SDO-AUX)*; USB1 3(SBU2) 4(CC1) 9(SBU1) 10(CC2)

## Notes on the sheet
- ESP8266
  中控芯片
- 电容按键
  交互按键
- 震动模块
- 12864OLED模块
- 选择性焊接
- 选择性焊接
- USB To TTL
  CH340
- 六轴传感器
- 二选一: V>0x6A/G>0x6B
- ——>
  二选一
  焊接
- 电源模块
  充电管理
- 薄膜压力传感器
